# EAGLE schematic ethernet chip (EAGLE 7.4.0)
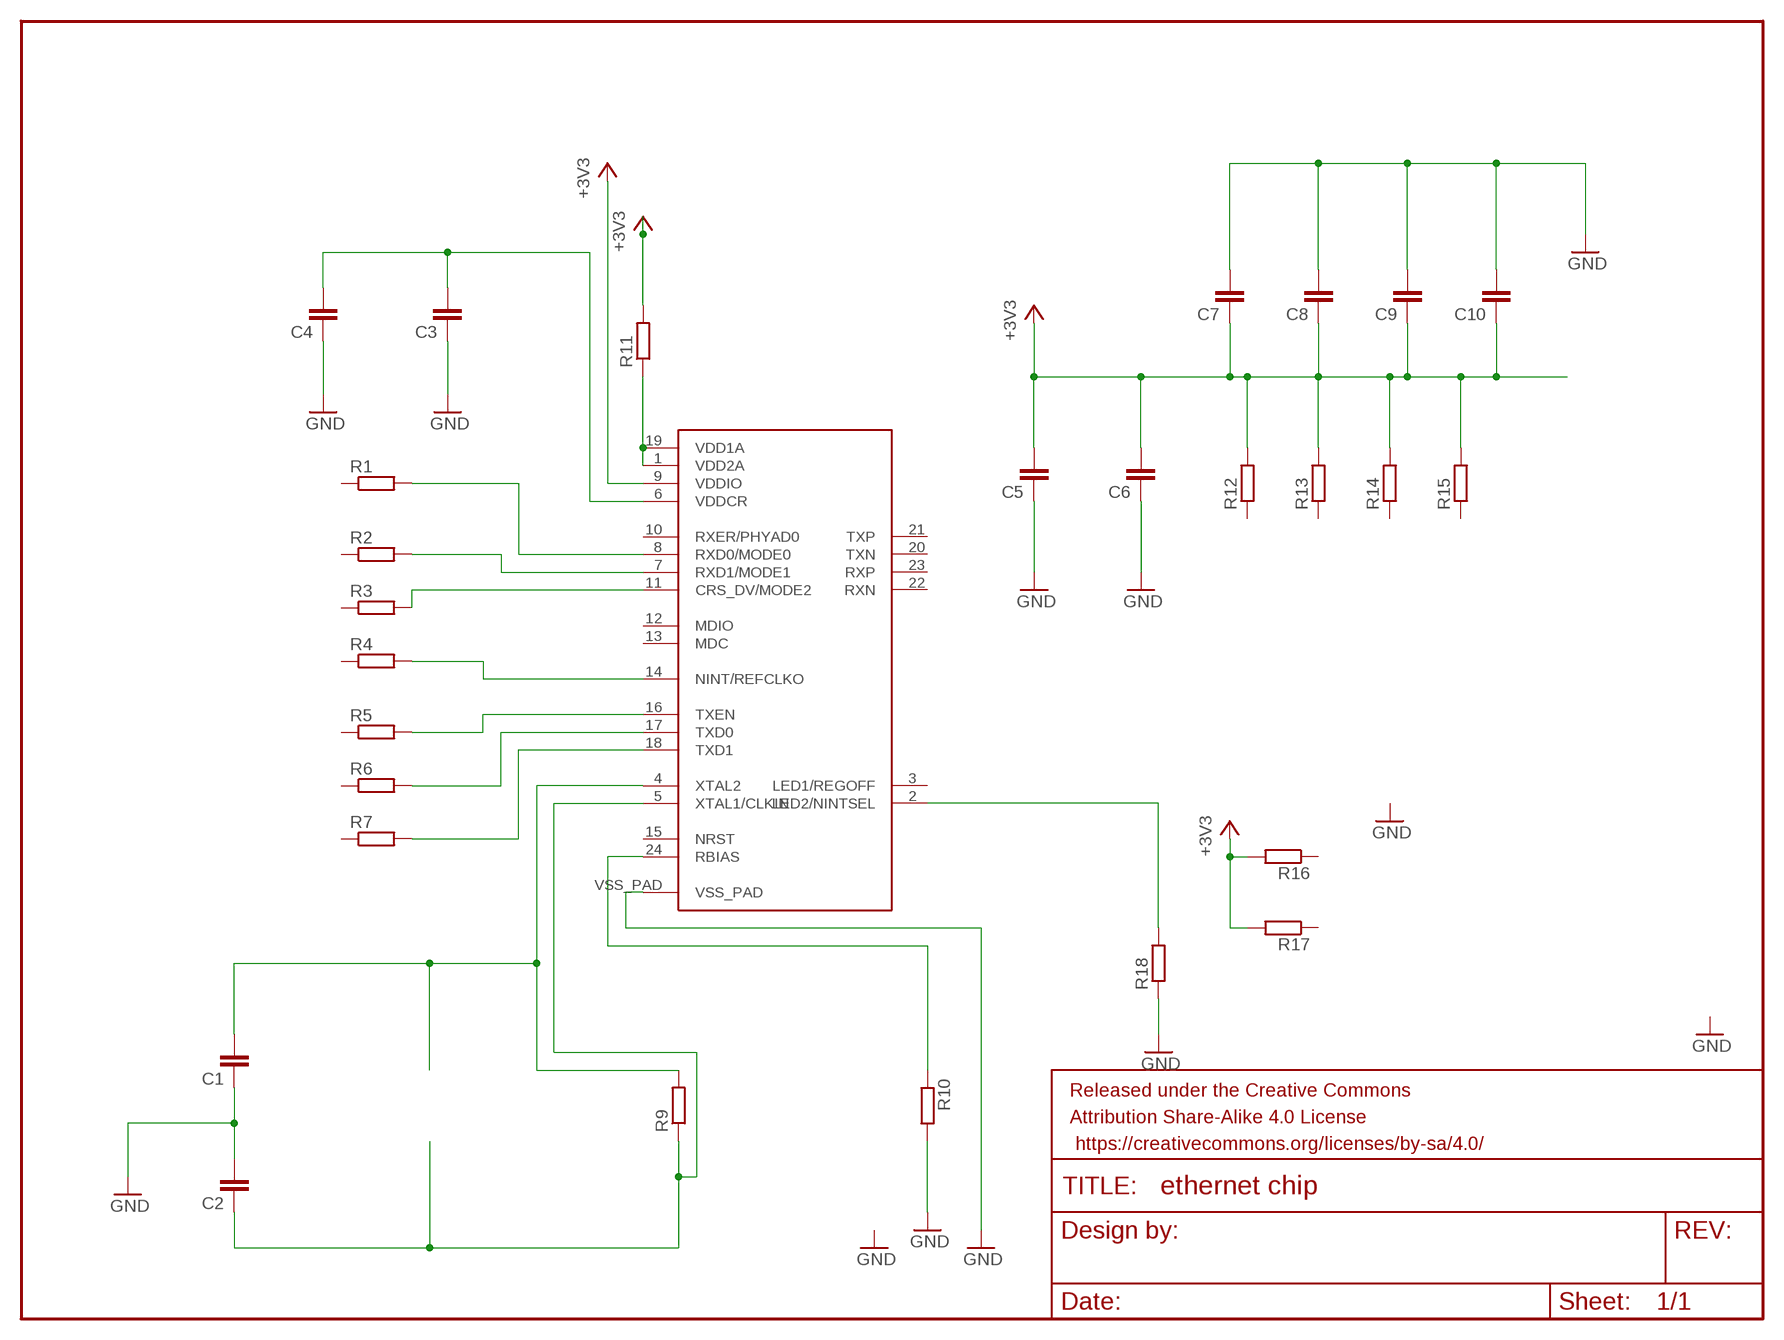
[diagram p0: schematic, sheet 1]

## Parts
C1  CC0603  [C0603]
C2  CC0603  [C0603]
C3  CC0603  [C0603]
C4  CC0603  [C0603]
C5  CC0603  [C0603]
C6  CC0603  [C0603]
C7  CC0603  [C0603]
C8  CC0603  [C0603]
C9  CC0603  [C0603]
C10  CC0603  [C0603]
FRAME1  FRAME-LETTER  [CREATIVE_COMMONS]
R1  RR0603  [R0603]
R2  RR0603  [R0603]
R3  RR0603  [R0603]
R4  RR0603  [R0603]
R5  RR0603  [R0603]
R6  RR0603  [R0603]
R7  RR0603  [R0603]
R9  RR0603  [R0603]
R10  RR0603  [R0603]
R11  RR0603  [R0603]
R12  RR0603  [R0603]
R13  RR0603  [R0603]
R14  RR0603  [R0603]
R15  RR0603  [R0603]
R16  RR0603  [R0603]
R17  RR0603  [R0603]
R18  RR0603  [R0603]
U$1  LAN8720LAN8720  [24-QFN]

## Nets
+3V3: C5.2 C6.2 C7.1 C8.1 C9.1 C10.1 R11.2 R12.2 R13.2 R14.2 R15.2 R16.2 R17.2 U$1.9(VDDIO)
GND: C1.1 C2.2 C3.1 C4.1 C5.1 C6.1 C7.2 C8.2 C9.2 C10.2 R10.2 R18.1 U$1.VSS_PAD
N$1: R1.2 U$1.8(RXD0/MODE0)
N$2: R2.2 U$1.7(RXD1/MODE1)
N$3: C3.2 C4.2 U$1.6(VDDCR)
N$4: R10.1 U$1.24(RBIAS)
N$5: R3.2 U$1.11(CRS_DV/MODE2)
N$6: C1.2 R9.2 U$1.4(XTAL2)
N$7: R4.2 U$1.14(NINT/REFCLKO)
N$8: R5.2 U$1.16(TXEN)
N$9: R6.2 U$1.17(TXD0)
N$10: R7.2 U$1.18(TXD1)
N$11: R11.1 U$1.1(VDD2A) U$1.19(VDD1A)
N$13: C2.1 R9.1 U$1.5(XTAL1/CLKIN)
N$14: R18.2 U$1.2(LED2/NINTSEL)
Unconnected: R1.1 R2.1 R3.1 R4.1 R5.1 R6.1 R7.1 R12.1 R13.1 R14.1 R15.1 R16.1 R17.1 U$1.3(LED1/REGOFF) U$1.10(RXER/PHYAD0) U$1.12(MDIO) U$1.13(MDC) U$1.15(NRST) U$1.20(TXN) U$1.21(TXP) U$1.22(RXN) U$1.23(RXP)

## Library data of the parts
C1-C10 = eagle-ltspice:C: CAPACITOR, European symbol; SPICEMODEL: NONE; SPICEPREFIX: C
FRAME1 = SparkFun-Aesthetics:FRAME-LETTER: Schematic Frame Standard 8.5x11 US Letter frame
R1-R7 R9-R18 = eagle-ltspice:R: RESISTOR, European symbol; SPICEMODEL: NONE; SPICEPREFIX: R
U$1 = Luke:LAN8720